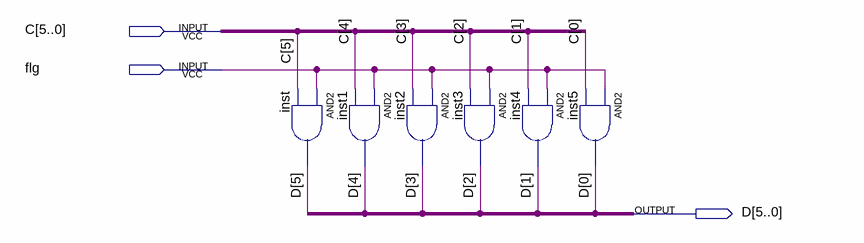
[diagram p0: schematic sheet]
// Quartus schematic flgAnd6.bdf as structural Verilog: 6 symbols, 3 pins
module flgAnd6 (
  input  [5:0] C,
  input  flg,
  output [5:0] D
);

  and inst (D[5], flg, C[5]);
  and inst1 (D[4], flg, C[4]);
  and inst2 (D[3], flg, C[3]);
  and inst3 (D[2], flg, C[2]);
  and inst4 (D[1], flg, C[1]);
  and inst5 (D[0], flg, C[0]);
endmodule
